# Altium schematic sheet SystemWiring.SchDoc: fNIRS System Wiring Diagram
size A4; CompanyName: UofT Capstone Team 2024991; DrawnBy: Tony Kim; Revision: 1; SheetNumber: 1; SheetTotal: 2
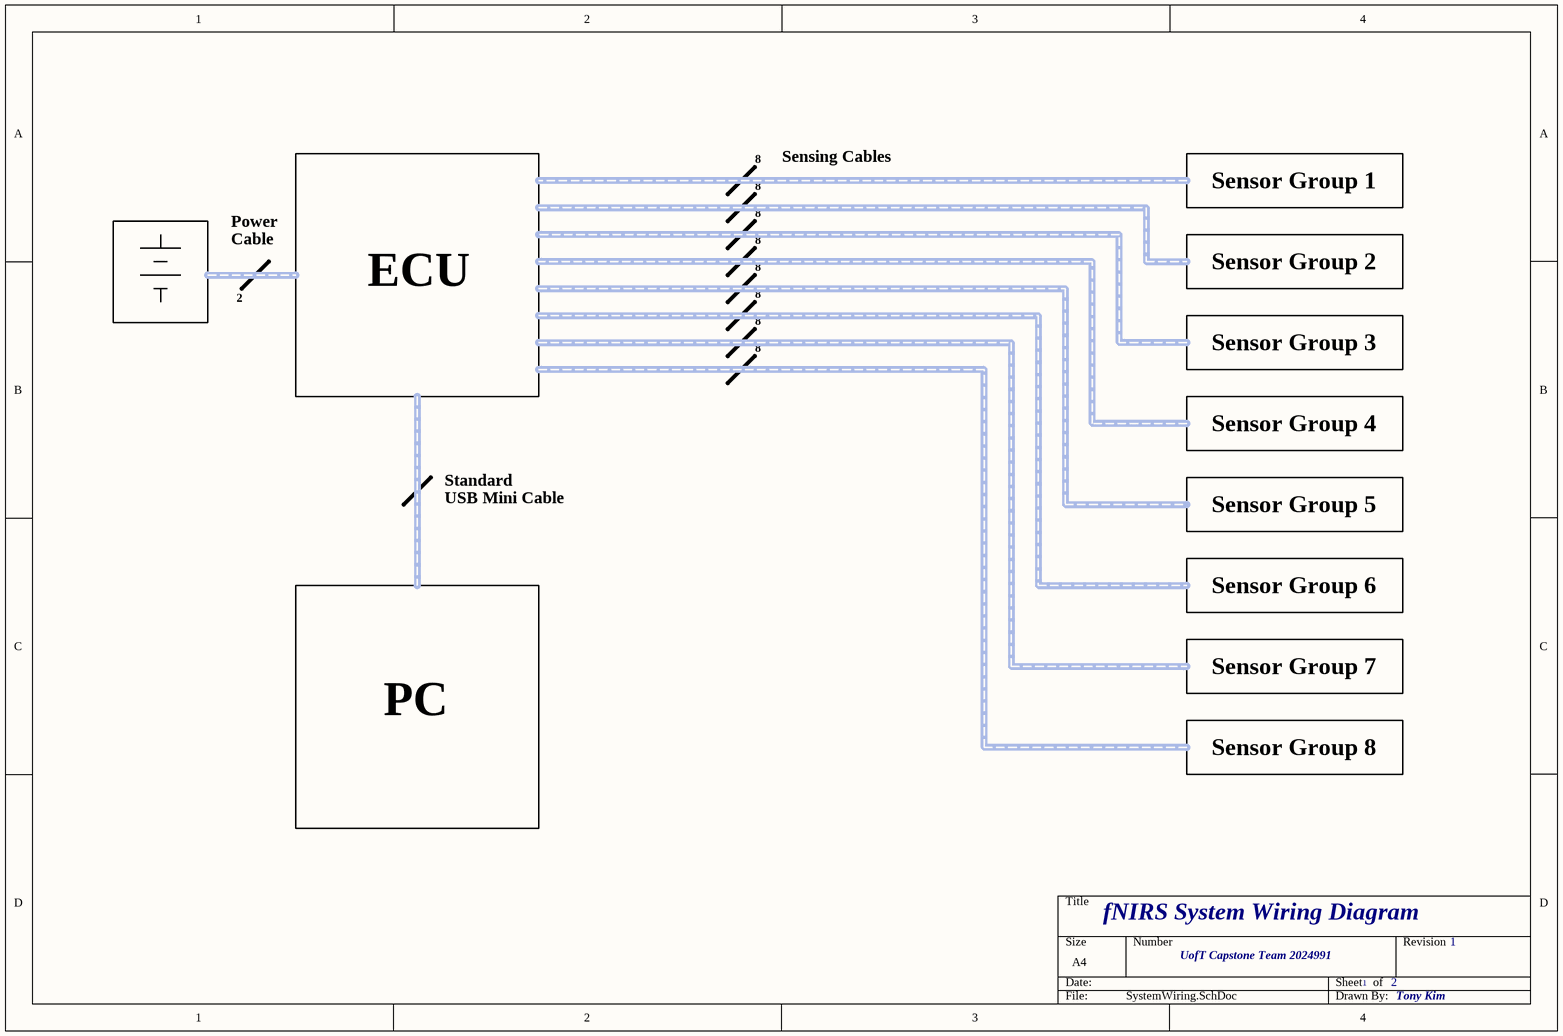
[diagram p0: SystemWiring.SchDoc]

## Notes on the sheet
- 8
- Sensing Cables
- Sensor Group 1
- Power
- Cable
- 2
- ECU
- Sensor Group 2
- Sensor Group 3
- Sensor Group 4
- USB Mini Cable
- Standard
- Sensor Group 5
- Sensor Group 6
- Sensor Group 7
- PC
- Sensor Group 8